# EAGLE design data (EAGLE 5.00)
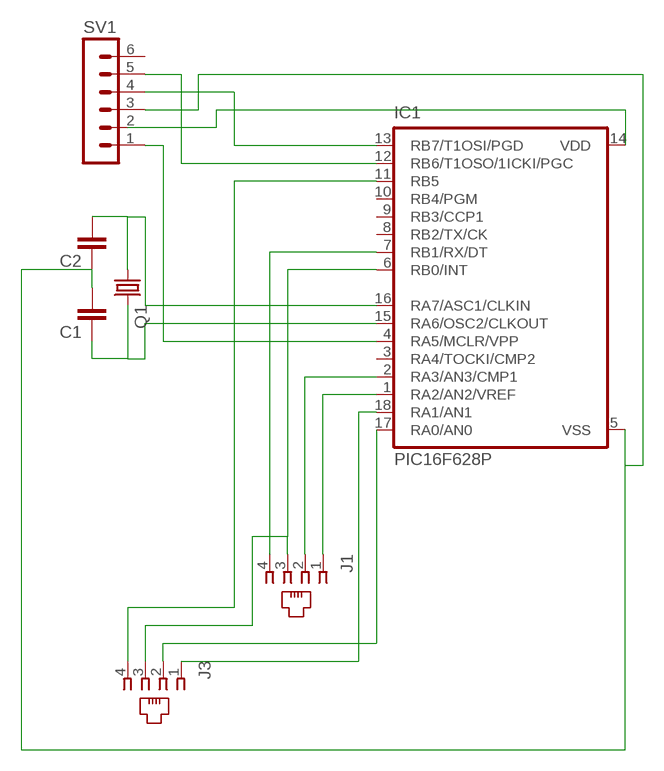
[diagram p0: schematic, sheet 1]

## Parts
C1  C2.5/2  [C2.5-2]
C2  C2.5/2  [C2.5-2]
IC1  PIC16F628P  [DIL18]
J1  520250-2  [520250-2]
J3  520250-2  [520250-2]
Q1  CRYSTALHC49S  [HC49/S]
SV1  MA06-1  [MA06-1]

## Nets
N$1: IC1.4(RA5/MCLR/VPP) SV1.1
N$2: C2.2 IC1.16(RA7/ASC1/CLKIN) Q1.1
N$3: C1.2 C2.1 IC1.5(VSS) SV1.3
N$4: C1.1 IC1.15(RA6/OSC2/CLKOUT) Q1.2
N$5: IC1.14(VDD)
N$6: IC1.1(RA2/AN2/VREF) J1.1
N$7: IC1.13(RB7/T1OSI/PGD) SV1.4
N$8: IC1.12(RB6/T1OSO/1ICKI/PGC) SV1.5
N$9: IC1.2(RA3/AN3/CMP1) J1.2
N$10: IC1.7(RB1/RX/DT) J1.4
N$12: IC1.18(RA1/AN1) J3.1
N$13: IC1.17(RA0/AN0) J3.2
N$14: IC1.11(RB5) J3.4
N$16: IC1.6(RB0/INT) J1.3 J3.3
Unconnected: IC1.3(RA4/TOCKI/CMP2) IC1.8(RB2/TX/CK) IC1.9(RB3/CCP1) IC1.10(RB4/PGM) SV1.2 SV1.6

## Library data of the parts
C1 C2 = capacitor-wima:C: CAPACITOR naming: grid - package width
IC1 = microchip:PIC16*F62: FLASH-Based 8-Bit CMOS Microcontroller Source: http://ww1.microchip.com/downloads/en/DeviceDoc/40300C.pdf
J1 J3 = con-amp:520250-2: AMP connector
Q1 = crystal:CRYSTAL: CRYSTAL
SV1 = con-lstb:MA06-1: PIN HEADER

## Board
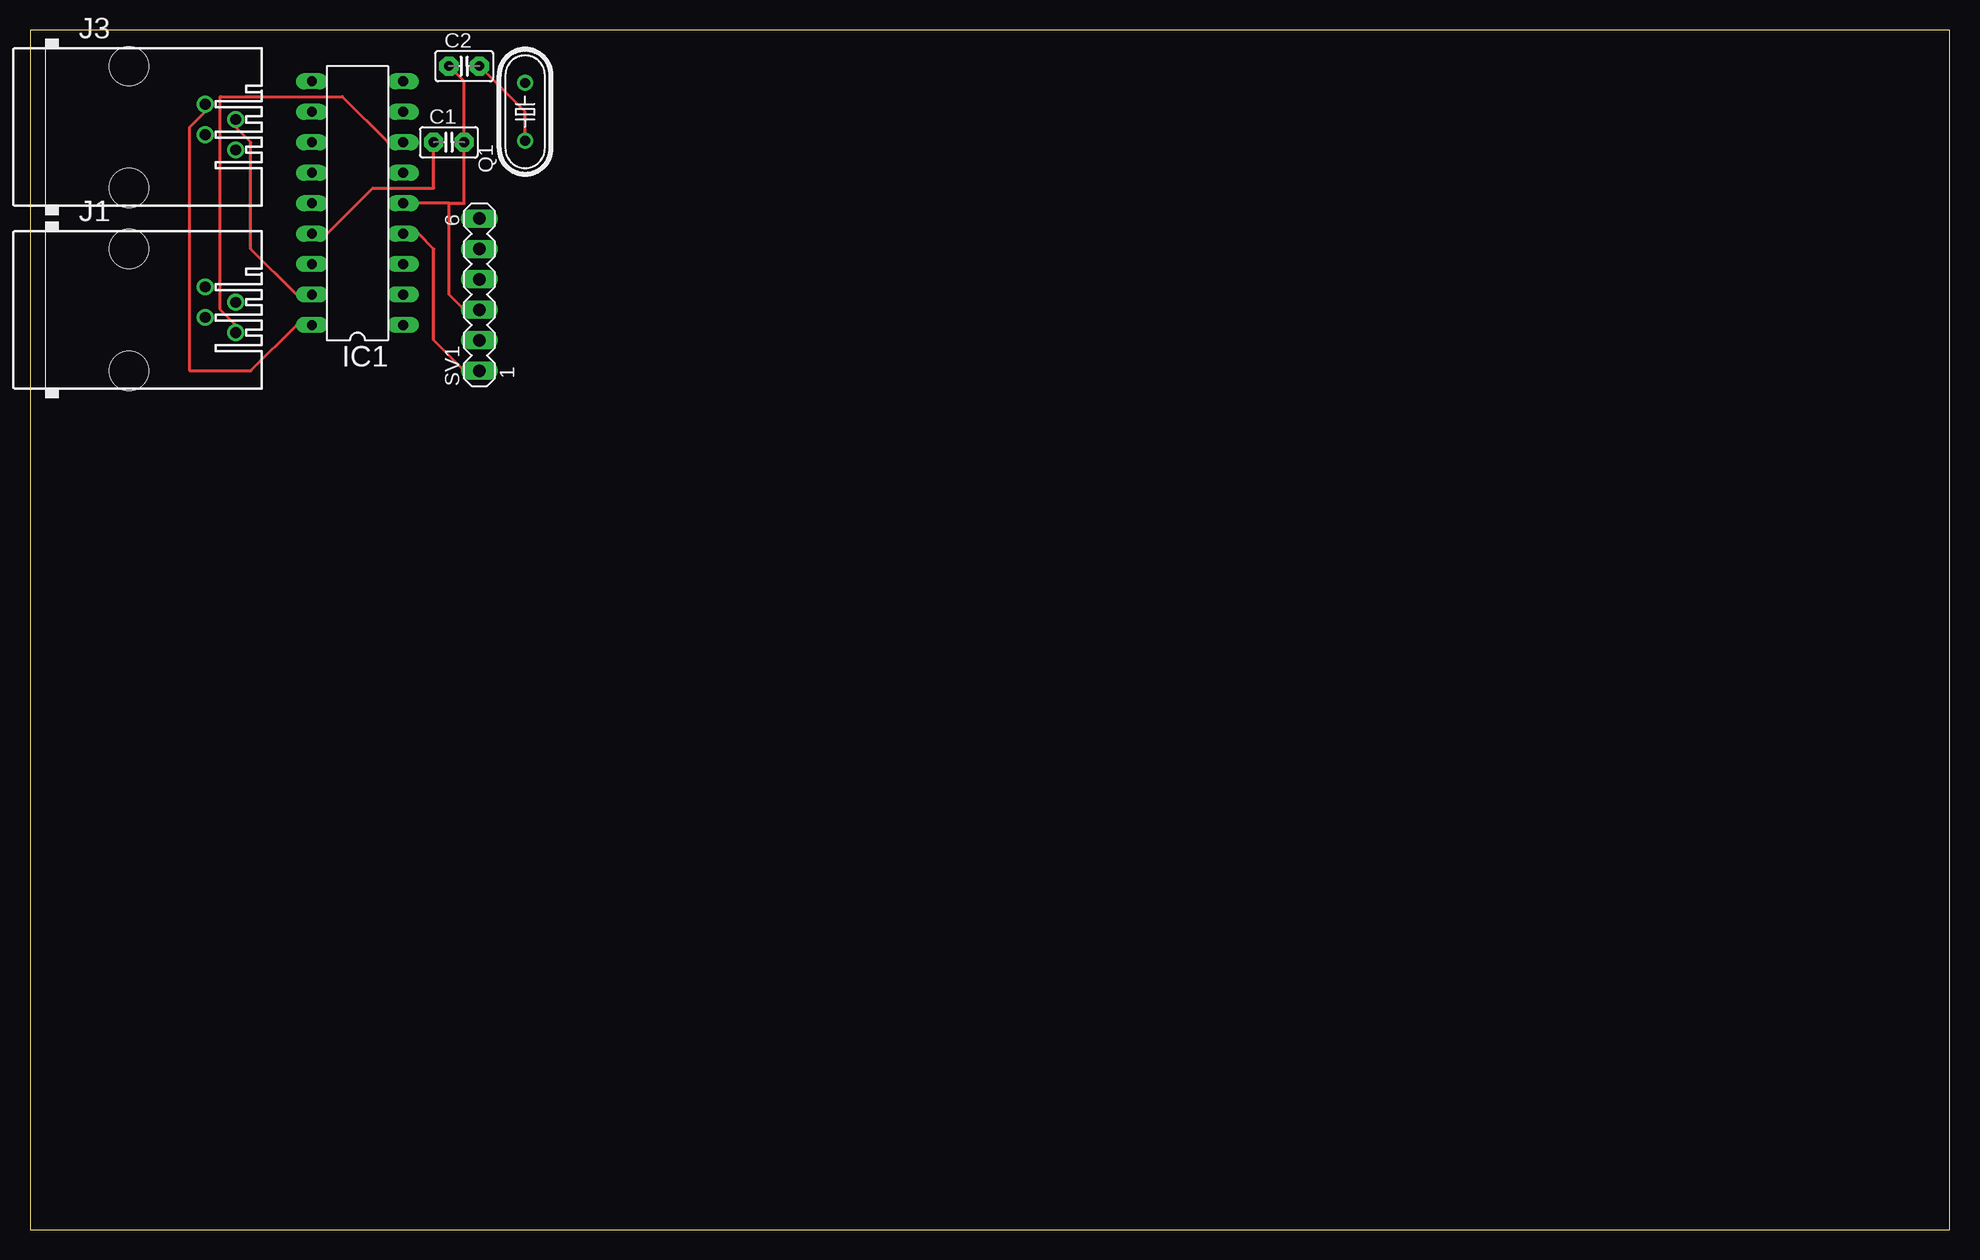
[diagram p1: board, top side]
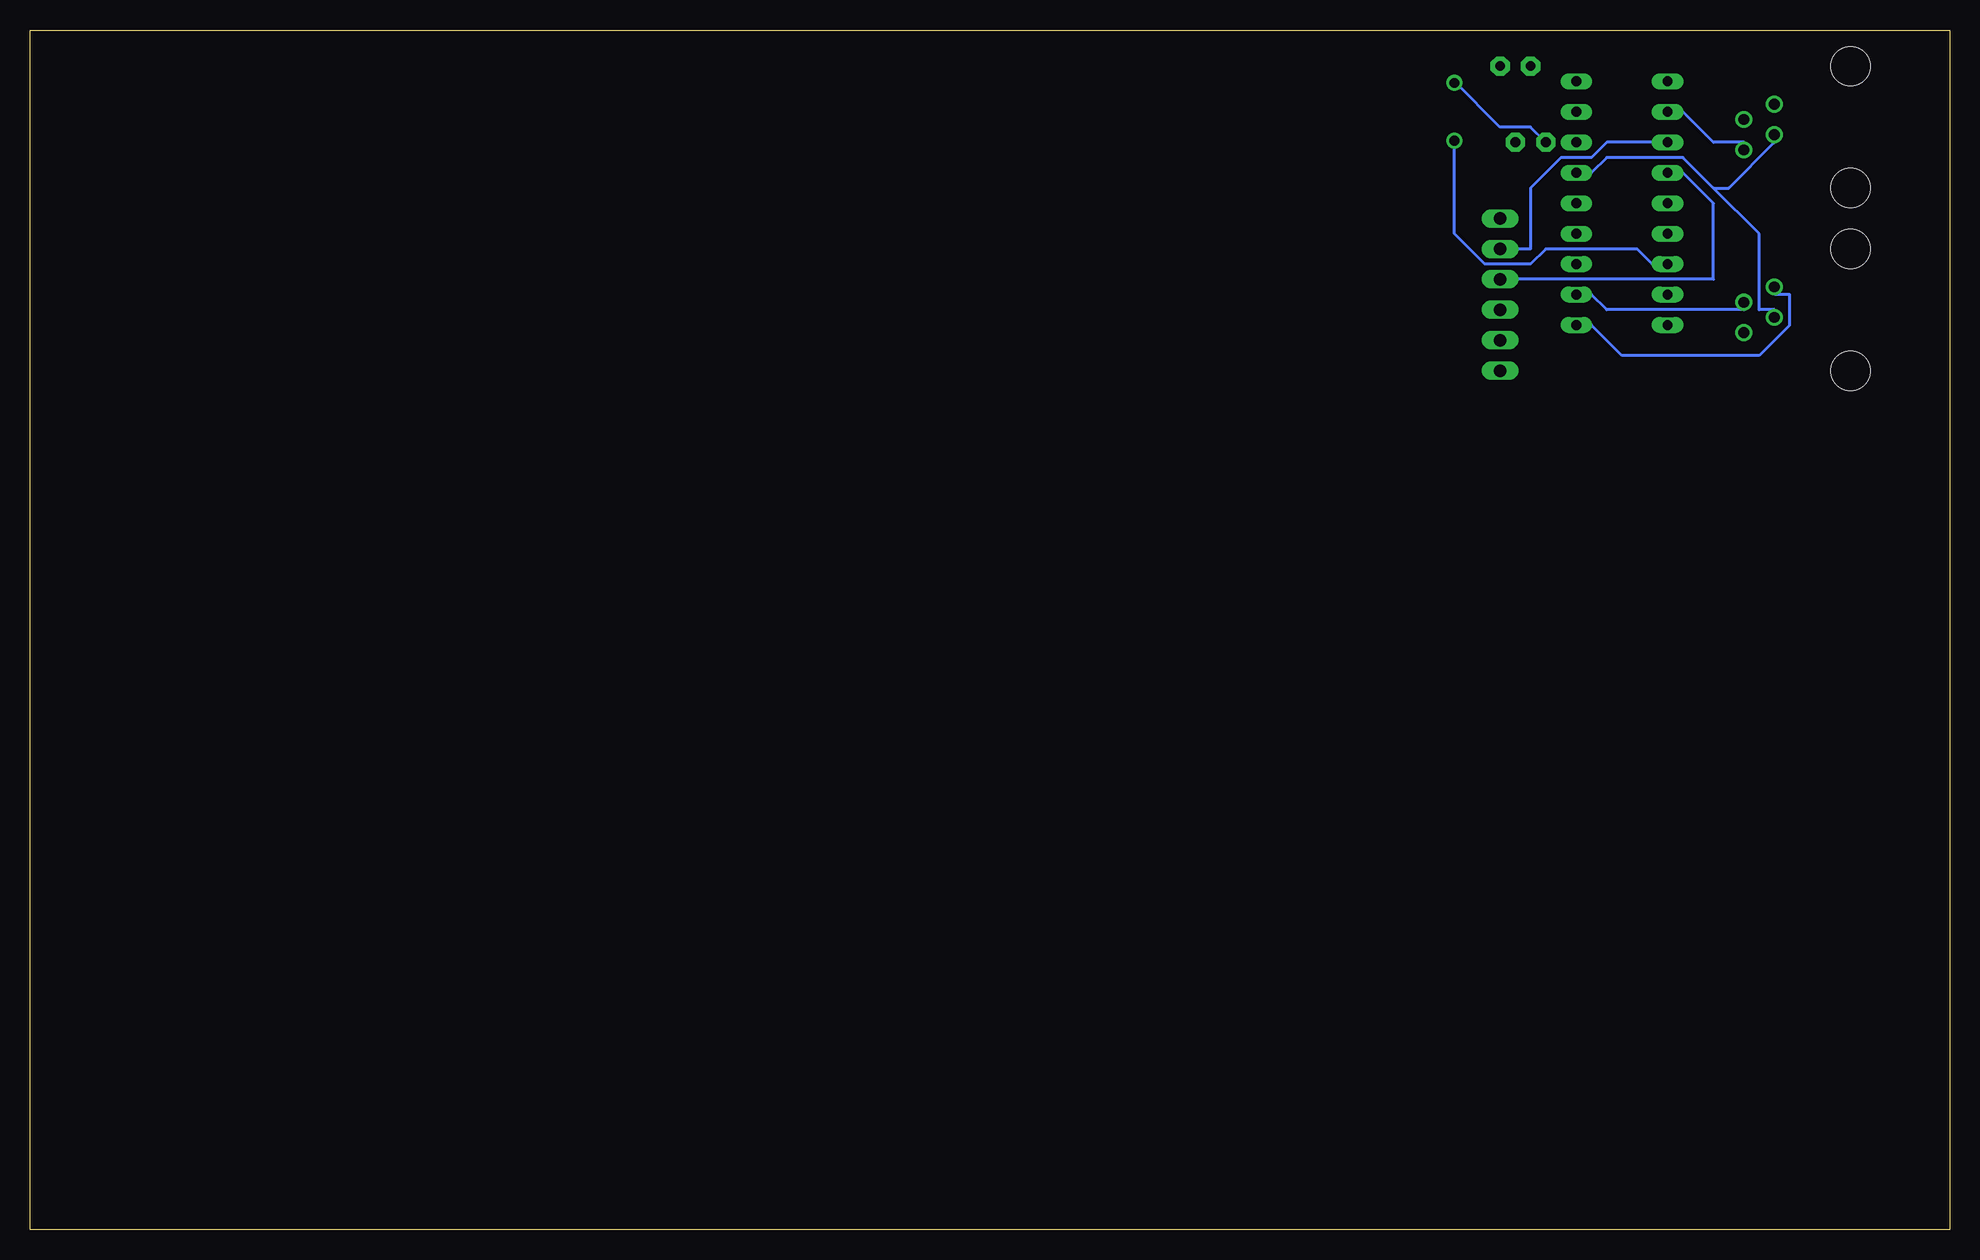
[diagram p2: board, bottom side, seen from below]

Size 160 x 100 mm. Coordinates in mm from the lower left corner, seen from the top.
Outline: 0,0 160,0 160,100 0,100 0,0
Copper layers (1*16): Top 0.035mm / dielectric 1.5mm / Bottom 0.035mm
Design rules "default": minimum track width 10mil, minimum drill 24mil, track to track 8mil, track to pad 8mil, pad to pad 8mil, via to via 8mil, smd to smd 8mil, copper to edge 40mil, drill to drill 8mil, minimum pad ring 10mil, minimum via ring 8mil, stop-mask expansion 4mil, vias tented up to drill 0mil, thermal gap 10mil

### Footprints (pad centres in the part's own frame; a part is rotated, then mirrored left to right if it is on the bottom)
C2.5-2 = drill 0.813 pad 1.6 octagon: 1 -1.27,0; 2 1.27,0
DIL18 = drill 0.813 long: 1 -10.16,-3.81; 2 -7.62,-3.81; 3 -5.08,-3.81; 4 -2.54,-3.81; 5 0,-3.81; 6 2.54,-3.81; 7 5.08,-3.81; 8 7.62,-3.81; 9 10.16,-3.81; 10 10.16,3.81; 11 7.62,3.81; 12 5.08,3.81; 13 2.54,3.81; 14 0,3.81; 15 -2.54,3.81; 16 -5.08,3.81; 17 -7.62,3.81; 18 -10.16,3.81
520250-2 = drill 0.889 round: 1 -1.905,6.35; 2 -0.635,8.89; 3 0.635,6.35; 4 1.905,8.89 | hole 3.251: -5.08,0; 5.08,0
HC49/S = drill 0.813 round: 1 -2.413,0; 2 2.413,0
MA06-1 = drill 1.016 long: 1 -6.35,0; 2 -3.81,0; 3 -1.27,0; 4 1.27,0; 5 3.81,0; 6 6.35,0

### Placement (x,y rotation side)
C1  34.92,90.64 0 top
C2  36.19,96.99 0 top
IC1  27.3,85.56 90 top
J1  8.25,76.67 270 top
J3  8.25,91.91 270 top
Q1  41.27,93.18 90 top
SV1  37.46,77.94 90 top

### Tracks (layer width: path | path; a pad name or v marks a point on that pad's centre or on a via)
N$1
  Top 0.254: IC1.4 32.38,83.02 33.65,81.75 33.65,74.13 36.19,71.59 SV1.1
N$2
  Top 0.254: C2.2 41.27,93.18 Q1.1 41.27,90.64
  Bottom 0.254: IC1.16 24.76,80.48 26.03,81.75 33.65,81.75 34.92,80.48 38.73,80.48 41.27,83.02 Q1.1
N$3
  Top 0.254: 34.92,85.56 36.19,85.56 C1.2 36.19,95.72 C2.1 | 34.92,85.56 IC1.5 | 34.92,85.56 34.92,77.94 36.19,76.67 SV1.3
N$4
  Top 0.254: C1.1 33.65,86.83 28.57,86.83 24.76,83.02 IC1.15
  Bottom 0.254: C1.1 34.92,91.91 37.46,91.91 41.27,95.72 Q1.2
N$6
  Bottom 0.254: IC1.1 29.84,75.4 27.3,72.86 15.87,72.86 13.33,75.4 13.33,77.94 14.6,77.94 J1.1
N$7
  Bottom 0.254: IC1.13 22.22,88.1 19.68,85.56 19.68,79.21 SV1.4
N$8
  Bottom 0.254: IC1.12 28.57,90.64 29.84,89.37 32.38,89.37 34.92,86.83 34.92,81.75 SV1.5
N$9
  Bottom 0.254: IC1.2 29.84,77.94 28.57,76.67 17.14,76.67 J1.2
N$10
  Top 0.254: IC1.7 29.84,90.64 26.03,94.45 15.87,94.45 15.87,76.67 17.14,75.4 J1.4
N$12
  Top 0.254: IC1.18 22.22,75.4 18.41,71.59 13.33,71.59 13.33,91.91 14.6,93.18 J3.1
N$13
  Top 0.254: IC1.17 22.22,77.94 18.41,81.75 18.41,90.64 17.14,91.91 J3.2
N$14
  Bottom 0.254: IC1.11 22.22,93.18 19.68,90.64 17.14,90.64 J3.4
N$16
  Bottom 0.254: 19.68,86.83 15.87,83.02 15.87,76.67 14.6,76.67 J1.3 | 19.68,86.83 22.22,89.37 28.57,89.37 29.84,88.1 IC1.6 | 19.68,86.83 18.41,86.83 14.6,90.64 J3.3